# Altium schematic sheet Power Supply.SchDoc
size 431 x 279 mm; Organization: ORGANIZATION; Address1: ADDRESS 1; Address2: ADDRESS 2; Address3: ADDRESS 3; Address4: ADDRESS 4; Revision: -; SheetNumber: 5; SheetTotal: 5; ENG_APP_DATE: --/--/--; DSN_APP_DATE: --/--/--; CHK_APP_DATE: --/--/--
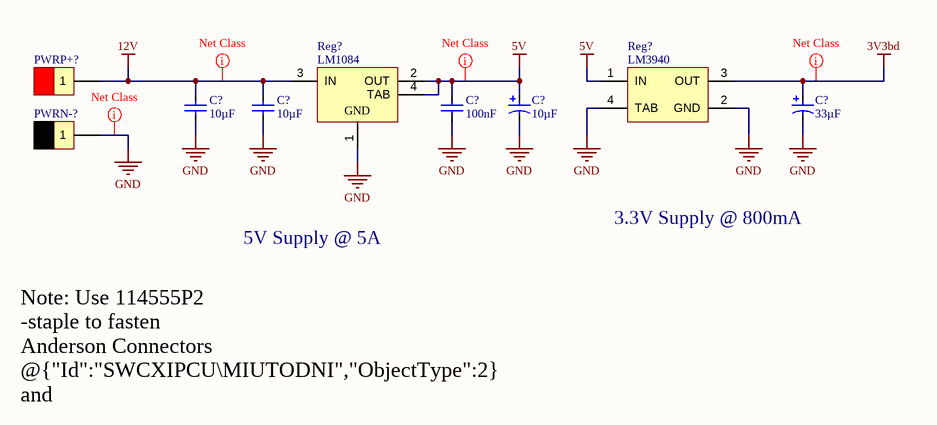
[diagram p0: Power Supply.SchDoc]

## Parts
(Parts that share a designator on the sheet are numbered #1, #2 ... from top to bottom, then left to right.)
C?#1  value 10µF  [CAPC2013X135X45ML10T25]  (hidden comment: CAP_Murata)
C?#2  value 10µF  [CAPC2013X135X45ML10T25]  (hidden comment: CAP_Murata)
C?#3  value 100nF  [0603C_L]  (hidden comment: Cap100nF_50V_0603)
C?#4  value 10µF  [AVX-TPSB106K020R1000_L]  (hidden comment: TPSB106K020R1000)
C?#5  value 33µF  [FP-TAJY-MFG]  (hidden comment: TAJY336K020RNJ)
PWRN-?  Anderson-1Pin BLK_PCB_RHT  [Anderson_BLK_RHT_BOT]  (value not drawn)
PWRP+?  Anderson-1Pin RED_PCB_RHT  [Anderson_RED_RHT_BOT]  (value not drawn)
Reg?#1  LM1084  [KTT0003B_L]
Reg?#2  LM3940  [SOT223]

## Nets
3V3bd: C?#5.2 Reg?#2.3(OUT)
5V: C?#3.2 C?#4.2 Reg?#1.2(OUT) Reg?#1.4(TAB) Reg?#2.1(IN)
12V: C?#1.2 C?#2.2 PWRP+?.1 Reg?#1.3(IN)
GND: C?#1.1 C?#2.1 C?#3.1 C?#4.1 C?#5.1 PWRN-?.1 Reg?#1.1(GND) Reg?#2.2(GND) Reg?#2.4(TAB)

## Layout directives
net class PowerNets: 3V3bd, 5V, 12V, GND

## Notes on the sheet
- 5V Supply @ 5A
- 3.3V Supply @ 800mA
- Note: Use 114555P2 -staple to fasten Anderson Connectors @{"Id":"SWCXIPCU\MIUTODNI","ObjectType":2} and @{"Id":"SWCXIPCU\MIUTODNI","ObjectType":2}
- DWG. NO.
- REV.
- SHT.
- THIS DOCUMENT AND THE DATA DISCLOSED HEREIN OR HEREWITH IS THE PROPERTY OF ALTIUM LIMITED AND MAY BE FREELY DISTRIBUTED IN WHOLE. NO RIGHTS ARE RESERVED OR EXPRESS OR IMPLIED WARANTEE GIVEN.
- REVISION
- DESCRIPTION
- DATE
- APPROVED
- ENG:
- DSN:
- APPROVALS
- PROJECT REVISION:
- www.altium.com <http://www.altium.com>
- DOCUMENT REVISION:
- 92037, La Jolla
- USA
- Altium Ltd.
- 4225 Executive Square
- CHK:
- REFERENCE DOCUMENTS
- DESIGN ITEM:
- TITLE
- VARIANT
- BOM:
- FAB DWG:
- PCB DWG:
- ASSY DWG:
- SCALE:
- SIZE
- B
- CAGE CODE
- FILE NAME
- DWG NO.
- SHEET
- OF
- REV

## Library data of the parts
C?#1 C?#2 = CMP-00043-1: Ceramic Capacitor, Multilayer, Ceramic, 25V, 10% +Tol, 10% -Tol, X5R, 15% TC, 10uF, Surface Mount, 0805; Tolerance: 10%; Case/Package: 0805; Max Operating Temperature: 85°C; Min Operating Temperature: -55°C; Mounting Technology: Surface Mount; Pins: 2; RoHS Compliant: Yes; Capacitor Type: Ceramic
C?#3 = CMP-00119-2: Ceramic Capacitor, Multilayer, Ceramic, 50V, 80% +Tol, 20% -Tol, Y5V, -82/+22% TC, 0.1uF, Surface Mount, 0603; Multilayer: Yes; Packaging: Tape and Reel; Case/Package: 0603; Dielectric Material: Ceramic; Height: 0.8mm; Length: 1.6mm; Max Operating Temperature: 85°C; Min Operating Temperature: -30°C; Mounting Technology: Surface Mount; Pins: 2; RoHS Compliant: Yes; Termination: Wraparound; Voltage Rating: 50V; Width: 0.8mm; Capacitor Type: Ceramic; JESD-609 Code: e3; Package Shape: Rectangular; Package Style: SMTMeter; Rated DC Voltage (URdc): 50V; Reach SVHC Compliant: Yes; Temperature Characteristics Code: Y5V; Terminal Finish: Nickel; Tolerance  (fill in as +-): 20%; Tolerance (fill in as +-): 80%
C?#4 = CMP-00072-1: Tantalum Capacitor, Polarized, Tantalum (dry/solid), 20V, 10% +Tol, 10% -Tol, 10uF, Surface Mount, 1210; ESR (Equivalent Series Resistance): 1R; Leakage Current: 2uA; Tan Delta: 0.06; Polarity: Polarized; JESD-609 Code: e3; Pins: 2; RoHS Compliant: Yes; Max Operating Temperature: 125°C; Package Style: SMTMeter; Height: 1.9mm; Termination: J BEND; Tolerance (fill in as +-): 10%; Reach SVHC Compliant: Yes; Rated DC Voltage (URdc): 20V; Package Shape: Rectangular; Min Operating Temperature: -55°C; Terminal Finish: Nickel; Packaging: Tape and Reel; Width: 2.8mm; Dielectric Material: Tantalum; Tolerance  (fill in as +-): 10%; Mounting Technology: Surface Mount; Capacitor Type: Tantalum; Case/Package: 1411; Length: 3.5mm
C?#5 = CMP-00012-1: Tantalum Capacitor, Polarized, Tantalum (dry/solid), 20V, 10% +Tol, 10% -Tol, 33uF, Surface Mount, 2917; Tan Delta: 0.06; ESR (Equivalent Series Resistance): 600mR; Leakage Current: 6.6uA; Max Operating Temperature: 125°C; Package Shape: Rectangular; Tolerance (fill in as +-): 10%; Rated DC Voltage (URdc): 20V; Height: 2mm; Case/Package: 2917; Packaging: Tape and Reel; Polarity: Polarized; JESD-609 Code: e3; Termination: J BEND; Tolerance  (fill in as +-): 10%; Terminal Finish: Nickel; Pins: 2; Length: 7.3mm; Width: 4.3mm; Dielectric Material: Tantalum; Min Operating Temperature: -55°C; Capacitor Type: Tantalum; Package Style: SMTMeter; Mounting Technology: Surface Mount; RoHS Compliant: Yes; Reach SVHC Compliant: Yes
PWRN-? = CMP-00198-1: Connector Accessory, Contact, Copper Alloy; Also Needed Part Nr !!!: 1327G6; Voltage Rating: 600V; Current Rating: 25A; Also Needed Description!!!: Blade Type Power Housing Connector; Approvals: ULV; Design Use: Power; DIN Conformance: No; Max Operating Temperature: 105°C; Min Operating Temperature: -20°C; RoHS Compliant: Yes; Connector Support Type: CONNECTOR ACCESSORY; IEC Conformance: No; Material: Copper Alloy; MIL Conformance: No; Mounting Style: RIGHT ANGLE; Reach SVHC Compliant: Yes; Terminal Length: 0.29inch; Termination: Solder; Voltage Rating (AC): 600V; Voltage Rating (DC): 600V
PWRP+? = CMP-00162-3: Connector Accessory, Contact, Copper Alloy; Also Needed Part Nr !!!: 1327; Voltage Rating: 600V; Current Rating: 25A; Also Needed Description!!!: Blade Type Power Housing Connector; Approvals: ULV; Design Use: Power; DIN Conformance: No; Connector Support Type: CONNECTOR ACCESSORY; IEC Conformance: No; Material: Copper Alloy; Max Operating Temperature: 105°C; MIL Conformance: No; Min Operating Temperature: -20°C; Mounting Style: RIGHT ANGLE; Reach SVHC Compliant: Yes; RoHS Compliant: Yes; Terminal Length: 0.29inch; Termination: Solder; Voltage Rating (AC): 600V; Voltage Rating (DC): 600V
Reg?#1 = CMP-00188-1: 5A Low Dropout Positive Regulators, 3-pin TO-263, Pb-Free; Manufacturer: Texas Instruments; PartNumber: LM1084IS-5.0/NOPB; PowerWise: N; PackageTopMarking: NSUZXYTTE#*LM1084*IS-5.0; High-Reliability: Y; CompType: LDO IC; Available Preview Images: 2D; ComponentLink1Description: Datasheet URL; PackageDescription: TO-263, Molded, .400 x .390 x .180in, 3 Lead, .1in Pitch, Surface Mount; RoHS: Y; PackageReference: KTT0003B; PinCount: 3; Code_JEDEC: MO-169-AA; ComponentLink1URL: http://www.ti.com/general/docs/lit/getliterature.tsp?genericPartNumber=LM1084&fileType=pdf; Manufacturer Part Number: LM1084IS-5.0/NOPB; Design Item ID: LM1084; Source: WCT.SchLib
Reg?#2 = CMP-00091-1: 1A Low Dropout Regulator for 5V to 3.3V Conversion, 4-pin SOT-223, Pb-Free; Manufacturer: Texas Instruments; Manufacturer Part Number: LM3940IMP-3.3/NOPB; PowerWise: N; CompType: LDO IC; PackageTopMarking: XYTT*L52B; Voltage Regulator Type: LDO; Regulator Output Type: Fixed; Polarity Type: Positive; Number of Outputs: 1; Input Voltage (Min): 4.5V; Input Voltage: 7.5V; Load Regulation: 50mV; Line Regulation: 40mV; Dropout Voltage@Current (Typ): 0.5@1A/0.11@100mA; Quiescent Current (Max): 15mA; PackageDescription: Molded SOT-223, 6.50 x 3.56 x 1.6mm Body, 4 Lead, 2.3mm Pitch; ComponentLink1URL: http://www.ti.com/general/docs/lit/getliterature.tsp?genericPartNumber=LM3940&fileType=pdf; PackageReference: DCY0004A; RoHS: Y; ComponentLink1Description: Datasheet URL; PinCount: 4; Code_JEDEC: TO-261-AA; Code_IPC: SOT223-4; Stock 1: 22816; Pricing 1: 1=1.49, 10=1.332, 100=1.0381, 500=0.8585 (USD); Topology: LDO; Output Voltage: 3.3V; Package Type: SOT-223; Packaging: Tape and Reel; Output Current: 1A; Operating Temp Range: -40C to 125C; Operating Temperature Classification: Automotive; Pin Count: 3 +Tab; Mounting: Surface Mount; ComponentLink2URL: https://datasheet.ciiva.com/48433/elnatsemico-spanungsregler-ldo-lm3940-en-48433415.pdf; ComponentLink2Description: https://datasheet.ciiva.com/48433/elnatsemico-spanungsregler-ldo-lm3940-en-48433415.pdf; ComponentLink3URL: https://datasheet.ciiva.com/49046/1896170-49046286.pdf; ComponentLink3Description: https://datasheet.ciiva.com/49046/1896170-49046286.pdf; ComponentLink4URL: https://datasheet.ciiva.com/46384/1882650-46384431.pdf; ComponentLink4Description: https://datasheet.ciiva.com/46384/1882650-46384431.pdf; Design Item ID: LM3940IMP-3.3/NOPB; Source: WCT.SchLib